# EAGLE design controller-nucleo64-prototype (EAGLE 7.7.0)
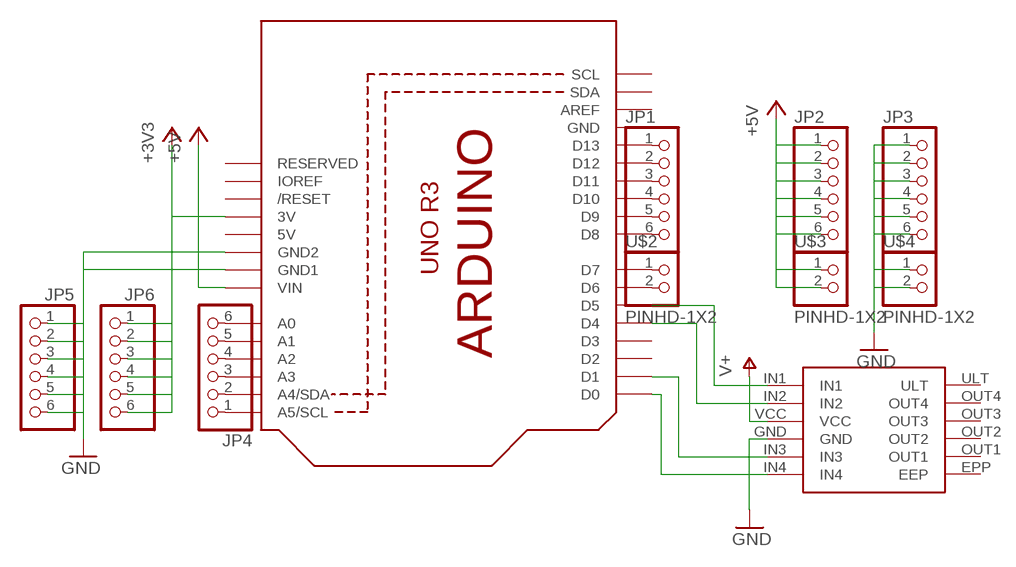
[diagram p0: schematic, sheet 1]

## Parts
JP1  PINHD-1X6CB  [1X06-CLEANBIG]
JP2  PINHD-1X6CB  [1X06-CLEANBIG]
JP3  PINHD-1X6CB  [1X06-CLEANBIG]
JP4  PINHD-1X6CB  [1X06-CLEANBIG]
JP5  PINHD-1X6CB  [1X06-CLEANBIG]
JP6  PINHD-1X6CB  [1X06-CLEANBIG]
U1  ARDUINOR3-DIMENSION  [ARDUINOR3]
U$1  DRV8833-MODULEUPSIDE-DOWN  [DRV8833-BRKOUT-INV]
U$2  PINHD-1X2  [1X02-CLEANBIG]
U$3  PINHD-1X2  [1X02-CLEANBIG]
U$4  PINHD-1X2  [1X02-CLEANBIG]

## Nets
+3V3: JP6.1 JP6.2 JP6.3 JP6.4 JP6.5 JP6.6 U1.3V
+5V: JP2.1 JP2.2 JP2.3 JP2.4 JP2.5 JP2.6 U1.VIN U$3.1 U$3.2
GND: JP3.1 JP3.2 JP3.3 JP3.4 JP3.5 JP3.6 JP5.1 JP5.2 JP5.3 JP5.4 JP5.5 JP5.6 U1.GND1 U1.GND2 U$1.GND U$4.1 U$4.2
N$1: U1.D0 U$1.IN4
N$2: U1.D1 U$1.IN3
N$3: U1.D4 U$1.IN2
N$4: U1.D5 U$1.IN1
N$5: JP1.1 U1.D13
N$6: JP1.2 U1.D12
N$7: JP1.3 U1.D11
N$8: JP1.4 U1.D10
N$9: JP1.5 U1.D9
N$10: JP1.6 U1.D8
N$11: JP4.1 U1.A5(A5/SCL)
N$12: JP4.2 U1.A4(A4/SDA)
N$13: JP4.3 U1.A3
N$14: JP4.4 U1.A2
N$15: JP4.5 U1.A1
N$16: JP4.6 U1.A0
N$18: U1.D7 U$2.1
N$19: U1.D6 U$2.2
V+: U$1.VCC
Unconnected: U1.AREF U1.D2 U1.D3 U1.IOREF U1.RESERVED U1.RESET(/RESET) U1.SCL U1.SDA U$1.EPP(EEP) U$1.OUT1 U$1.OUT2 U$1.OUT3 U$1.OUT4 U$1.ULT

## Power pins joined to a net without a drawn wire
5V: U1.5V
GND: U1.GND

## Library data of the parts
JP1-JP6 = adafruit:PINHD-1X6: PIN HEADER
U1 = adafruit:ARDUINOR3: This is a new object for the new Arduino R3 - with extra pins that you may want to use (such as IOref, and duplicated A4/A5
U$1 = assorted:DRV8833-MODULE
U$2-U$4 = assorted:PINHD-1X2

## Board
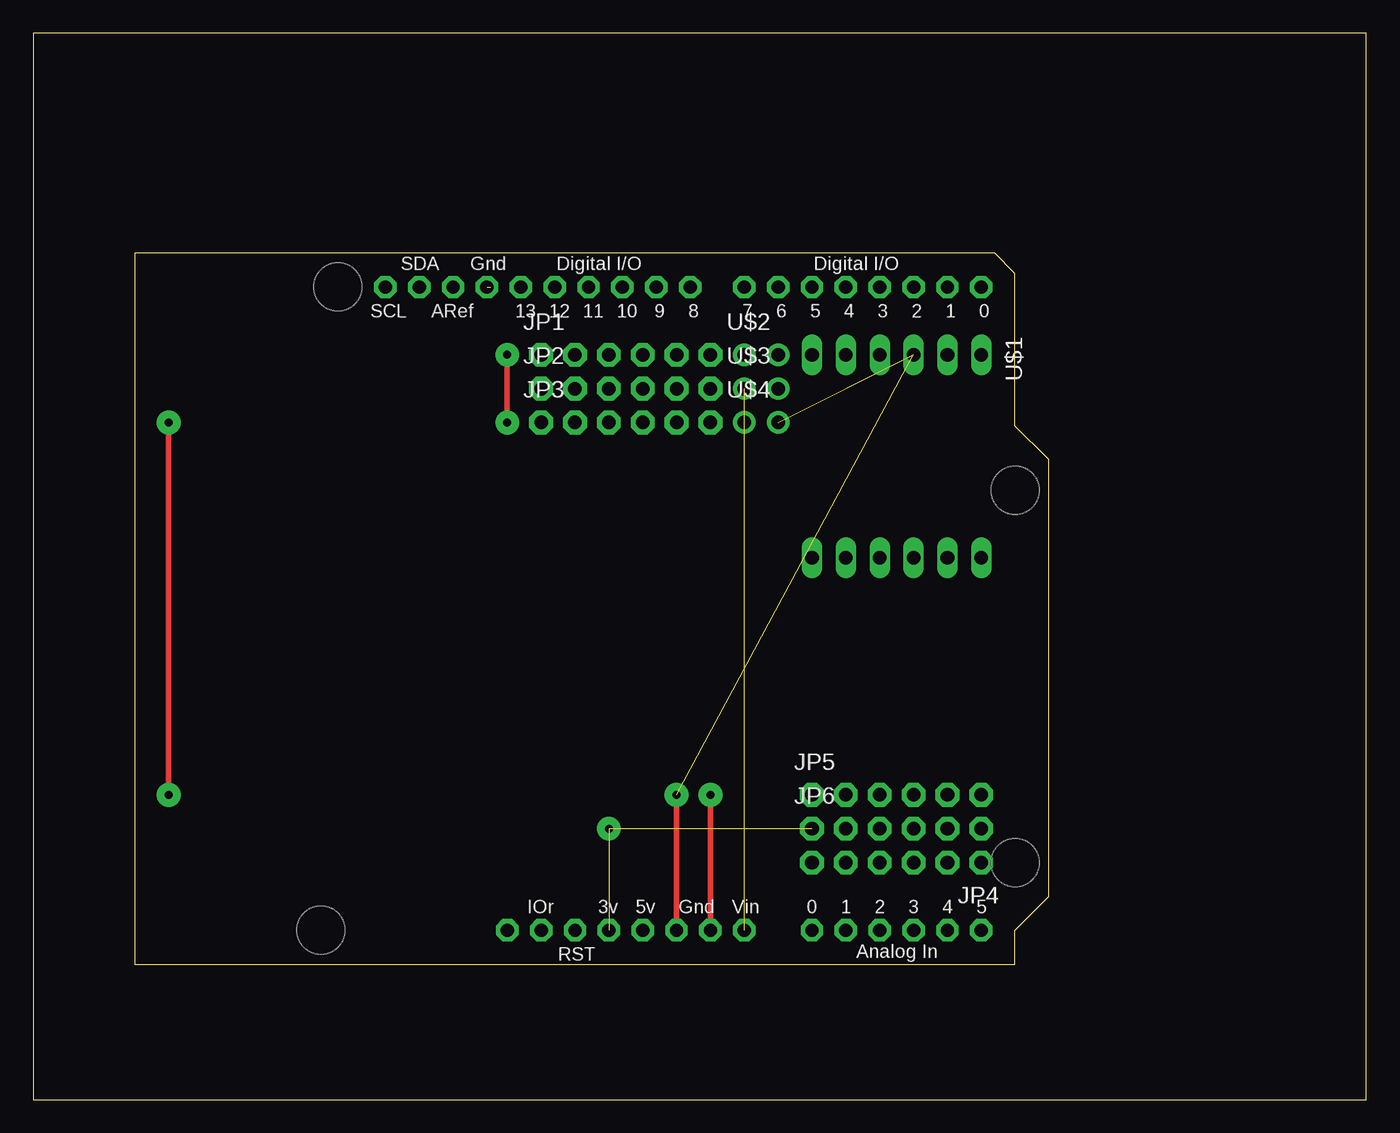
[diagram p1: board, top side]
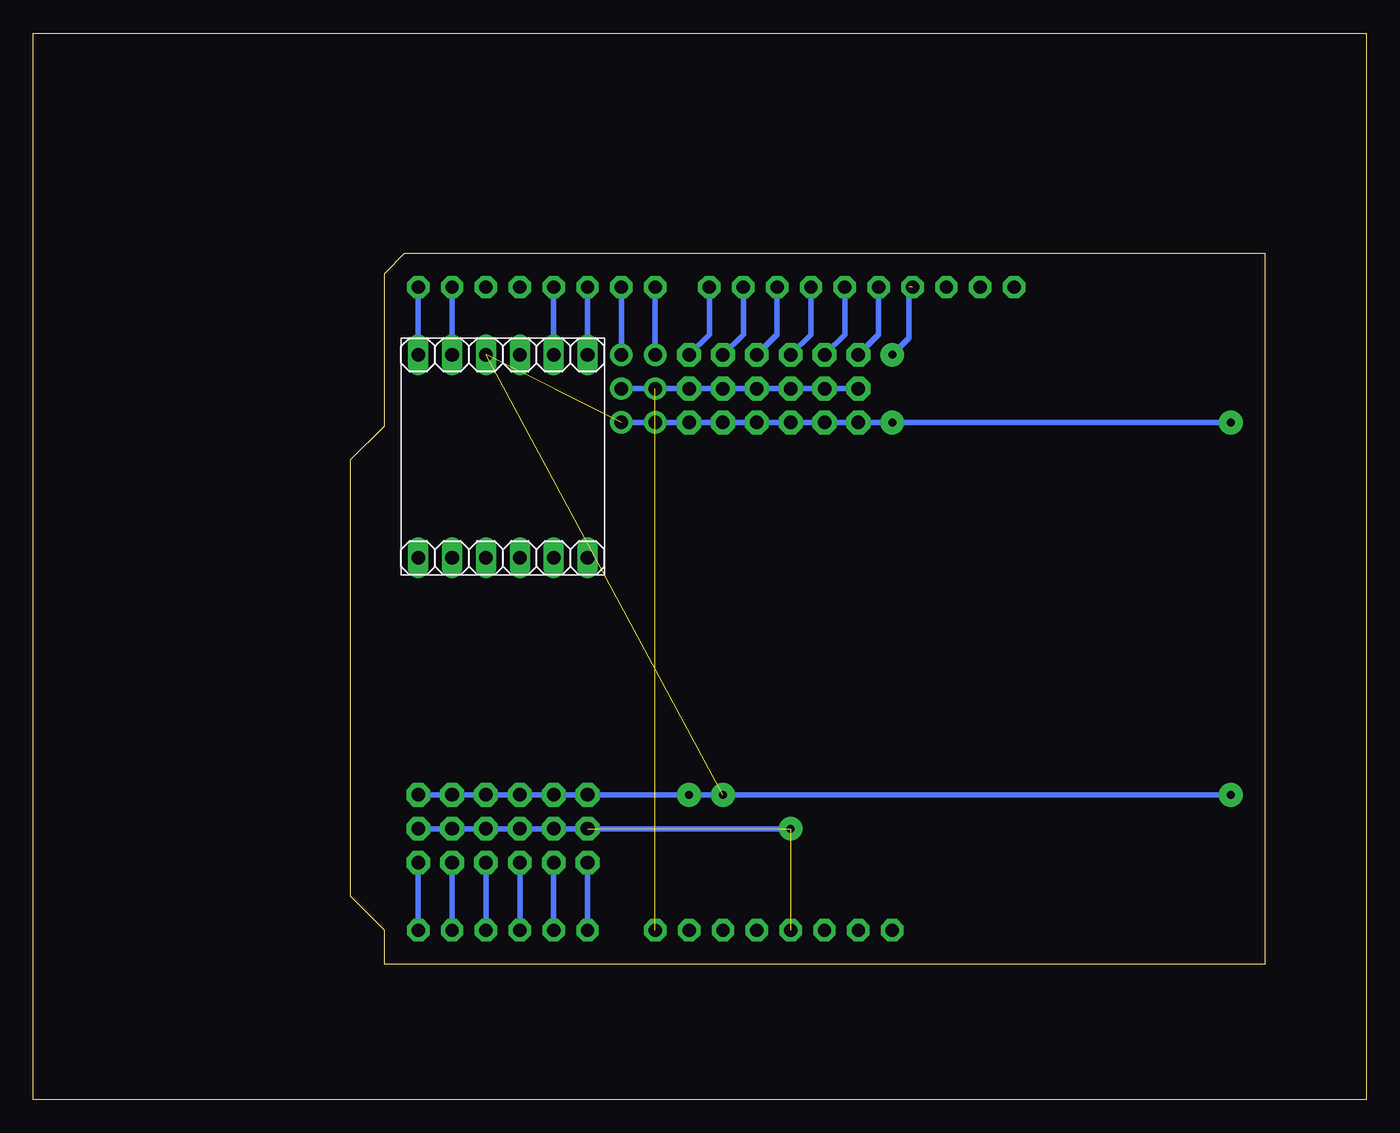
[diagram p2: board, bottom side, seen from below]

Size 100 x 80 mm. Coordinates in mm from the lower left corner, seen from the top.
Outline: 0,0 100,0 100,80 0,80 0,0
Copper layers (1*16): Top 0.035mm / dielectric 1.5mm / Bottom 0.035mm
Design rules "default": minimum track width 10mil, minimum drill 24mil, track to track 8mil, track to pad 8mil, pad to pad 8mil, via to via 8mil, smd to smd 8mil, copper to edge 40mil, drill to drill 8mil, minimum pad ring 10mil, minimum via ring 8mil, stop-mask expansion 4mil, vias tented up to drill 0mil, thermal gap 10mil

### Footprints (pad centres in the part's own frame; a part is rotated, then mirrored left to right if it is on the bottom)
1X06-CLEANBIG = drill 1.016 pad 1.778 octagon: 1 -6.35,0; 2 -3.81,0; 3 -1.27,0; 4 1.27,0; 5 3.81,0; 6 6.35,0
ARDUINOR3 = drill 1 pad 1.676 octagon: 3V 35.56,2.54; 5V 38.1,2.54; A0 50.8,2.54; A1 53.34,2.54; A2 55.88,2.54; A3 58.42,2.54; A4 60.96,2.54; A5 63.5,2.54; AREF 23.876,50.8; D0 63.5,50.8; D1 60.96,50.8; D2 58.42,50.8; D3 55.88,50.8; D4 53.34,50.8; D5 50.8,50.8; D6 48.26,50.8; D7 45.72,50.8; D8 41.656,50.8; D9 39.116,50.8; D10 36.576,50.8; D11 34.036,50.8; D12 31.496,50.8; D13 28.956,50.8; GND 26.416,50.8; GND1 43.18,2.54; GND2 40.64,2.54; IOREF 30.48,2.54; RESERVED 27.94,2.54; RESET 33.02,2.54; SCL 18.796,50.8; SDA 21.336,50.8; VIN 45.72,2.54
DRV8833-BRKOUT-INV = drill 1.016 long: EPP 7.62,6.35; GND -7.62,1.27; IN1 -7.62,-6.35; IN2 -7.62,-3.81; IN3 -7.62,3.81; IN4 -7.62,6.35; OUT1 7.62,3.81; OUT2 7.62,1.27; OUT3 7.62,-1.27; OUT4 7.62,-3.81; ULT 7.62,-6.35; VCC -7.62,-1.27
1X02-CLEANBIG = drill 1.016 pad 1.676: 1 -2.54,0; 2 0,0

### Placement (x,y rotation side)
JP1  44.45,55.88 0 top
JP2  44.45,53.34 0 top
JP3  44.45,50.8 0 top
JP4  64.77,17.78 180 top
JP5  64.77,22.86 0 top
JP6  64.77,20.32 0 top
U1  7.62,10.16 0 top
U$1  64.77,48.26 270 top
U$2  55.88,55.88 0 top
U$3  55.88,53.34 0 top
U$4  55.88,50.8 0 top

### Tracks (layer width: path | path; a pad name or v marks a point on that pad's centre or on a via)
+3V3  (via drill 0.6 pad 1.78)  (2 unrouted)
  Bottom 0.406: JP6.6 JP6.5 JP6.4 JP6.3 JP6.2 JP6.1 v43.18,20.32
+5V  (1 unrouted)
  Bottom 0.406: JP2.1 JP2.2 JP2.3 JP2.4 JP2.5 JP2.6 U$3.2 U$3.1
GND  (via drill 0.6 pad 1.78)  (3 unrouted)
  Top 0.406: v35.56,55.88 v35.56,50.8 | U1.GND2 v48.26,22.86 | U1.GND1 v50.8,22.86 | v10.16,50.8 v10.16,22.86
  Bottom 0.406: JP5.6 JP5.5 JP5.4 JP5.3 JP5.2 JP5.1 v50.8,22.86 v48.26,22.86 v10.16,22.86 | U$4.2 U$4.1 JP3.6 JP3.5 JP3.4 JP3.3 JP3.2 JP3.1 v35.56,50.8 v10.16,50.8 | 34.29,60.96 34.29,57.15 v35.56,55.88
N$1
  Bottom 0.406: U1.D0 U$1.IN4
N$2
  Bottom 0.406: U1.D1 U$1.IN3
N$3
  Bottom 0.406: U1.D4 U$1.IN2
N$4
  Bottom 0.406: U1.D5 U$1.IN1
N$5
  Bottom 0.406: U1.D13 36.58,57.4 JP1.1
N$6
  Bottom 0.406: U1.D12 39.12,57.4 JP1.2
N$7
  Bottom 0.406: U1.D11 41.66,57.4 JP1.3
N$8
  Bottom 0.406: U1.D10 44.2,57.4 JP1.4
N$9
  Bottom 0.406: U1.D9 46.74,57.4 JP1.5
N$10
  Bottom 0.406: U1.D8 49.28,57.4 JP1.6
N$11
  Bottom 0.406: JP4.1 U1.A5
N$12
  Bottom 0.406: JP4.2 U1.A4
N$13
  Bottom 0.406: JP4.3 U1.A3
N$14
  Bottom 0.406: JP4.4 U1.A2
N$15
  Bottom 0.406: JP4.5 U1.A1
N$16
  Bottom 0.406: JP4.6 U1.A0
N$18
  Bottom 0.406: U1.D7 U$2.1
N$19
  Bottom 0.406: U1.D6 U$2.2